# EAGLE design 1-4 (EAGLE 9.6.2)
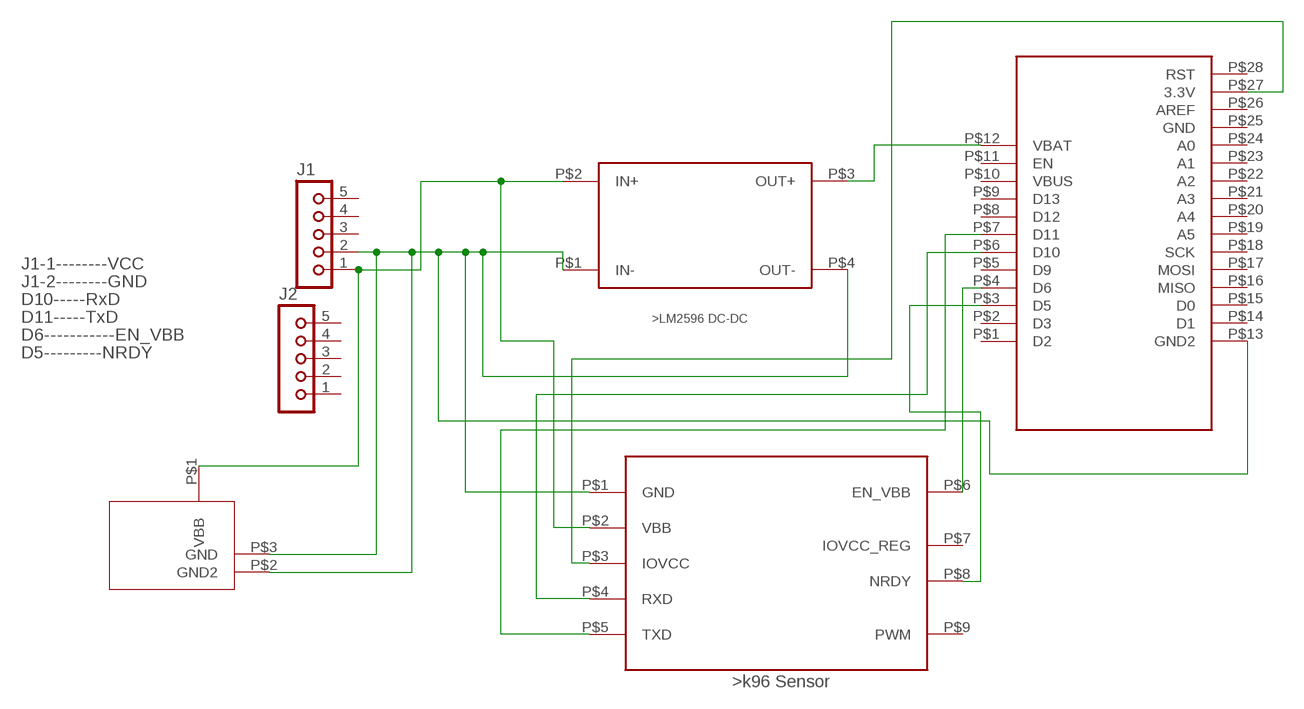
[diagram p0: schematic, sheet 1]

## Parts
DCDC1  DCDC  [DCDC]
FEATHER1  FEATHER  [FEATHER]
J1  JU05  [JU05]
J2  JU05  [JU05]
K96SENSOR1  K96SENSOR  [K96SENSOR]
U$1  POWER  [POWERIN]

## Nets
N$1: DCDC1.P$2(IN+) J1.1 K96SENSOR1.P$2(VBB) U$1.P$1(VBB)
N$2: DCDC1.P$1(IN-) DCDC1.P$4(OUT-) FEATHER1.P$13(GND2) J1.2 K96SENSOR1.P$1(GND) U$1.P$2(GND2) U$1.P$3(GND)
N$3: FEATHER1.P$6(D10) K96SENSOR1.P$4(RXD)
N$4: DCDC1.P$3(OUT+) FEATHER1.P$12(VBAT)
N$5: FEATHER1.P$7(D11) K96SENSOR1.P$5(TXD)
N$6: FEATHER1.P$4(D6) K96SENSOR1.P$6(EN_VBB)
N$7: FEATHER1.P$3(D5) K96SENSOR1.P$8(NRDY)
N$9: FEATHER1.P$27(3.3V) K96SENSOR1.P$3(IOVCC)
Unconnected: FEATHER1.P$1(D2) FEATHER1.P$2(D3) FEATHER1.P$5(D9) FEATHER1.P$8(D12) FEATHER1.P$9(D13) FEATHER1.P$10(VBUS) FEATHER1.P$11(EN) FEATHER1.P$14(D1) FEATHER1.P$15(D0) FEATHER1.P$16(MISO) FEATHER1.P$17(MOSI) FEATHER1.P$18(SCK) FEATHER1.P$19(A5) FEATHER1.P$20(A4) FEATHER1.P$21(A3) FEATHER1.P$22(A2) FEATHER1.P$23(A1) FEATHER1.P$24(A0) FEATHER1.P$25(GND) FEATHER1.P$26(AREF) FEATHER1.P$28(RST) J1.3 J1.4 J1.5 J2.1 J2.2 J2.3 J2.4 J2.5 K96SENSOR1.P$7(IOVCC_REG) K96SENSOR1.P$9(PWM)

## Notes on the sheet
- J1-1--------VCC
- J1-2--------GND
- D10-----RxD
- D11-----TxD
- D6-----------EN_VBB
- D5---------NRDY

## Library data of the parts
DCDC1 = untitled:DCDC
FEATHER1 = untitled:FEATHER
J1 J2 = con-lsta:JU05: PIN HEADER; OC_FARNELL: unknown; OC_NEWARK: unknown
K96SENSOR1 = untitled:K96SENSOR
U$1 = untitled:POWER

## Board
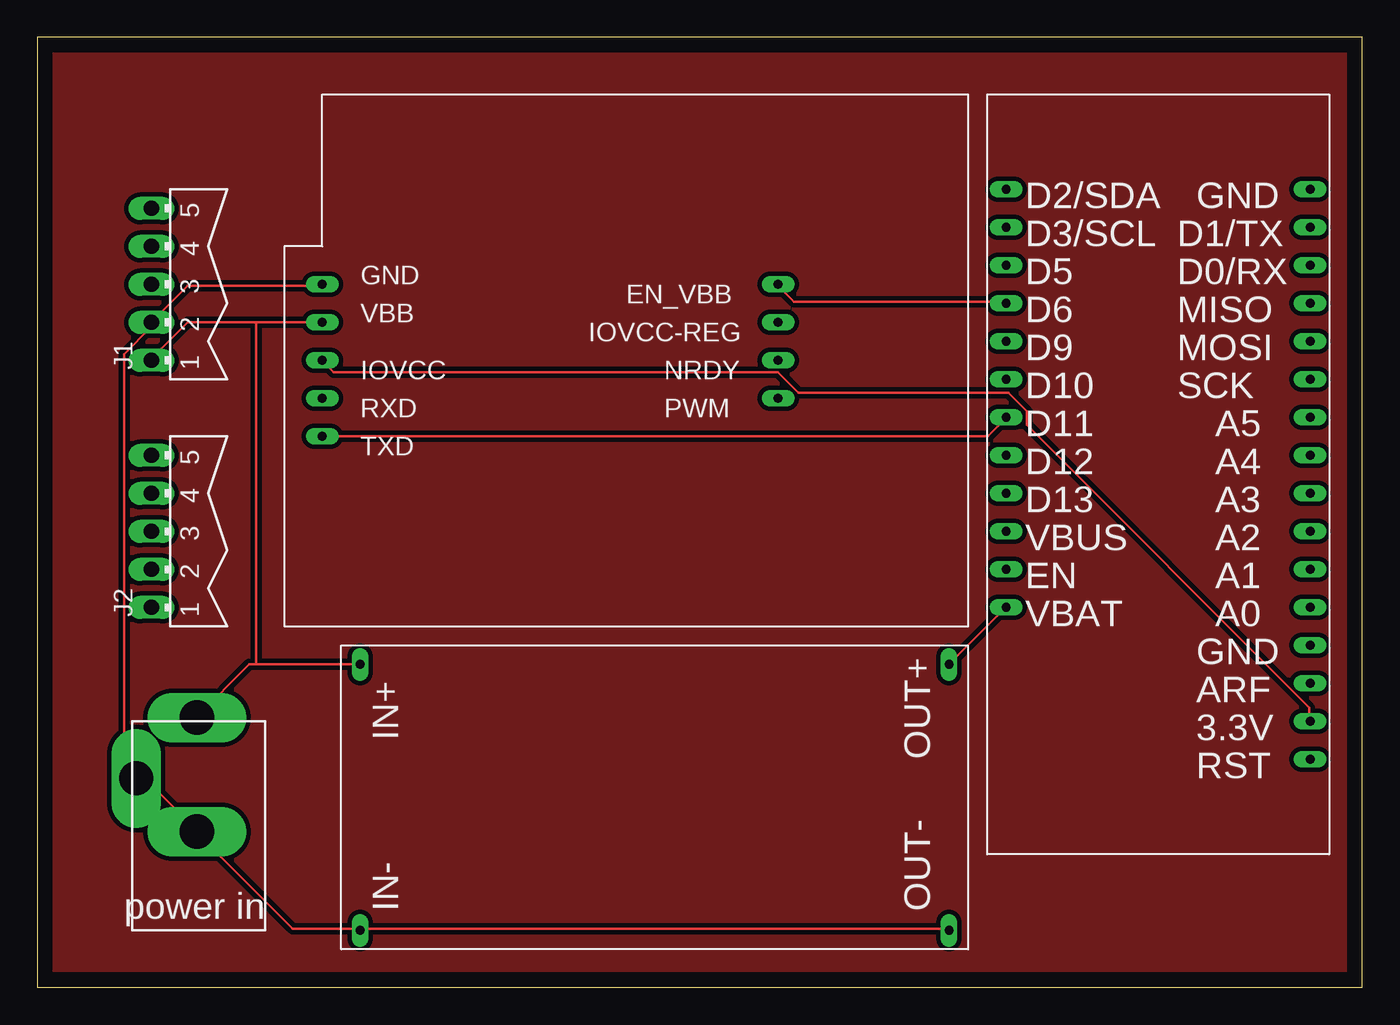
[diagram p1: board, top side]
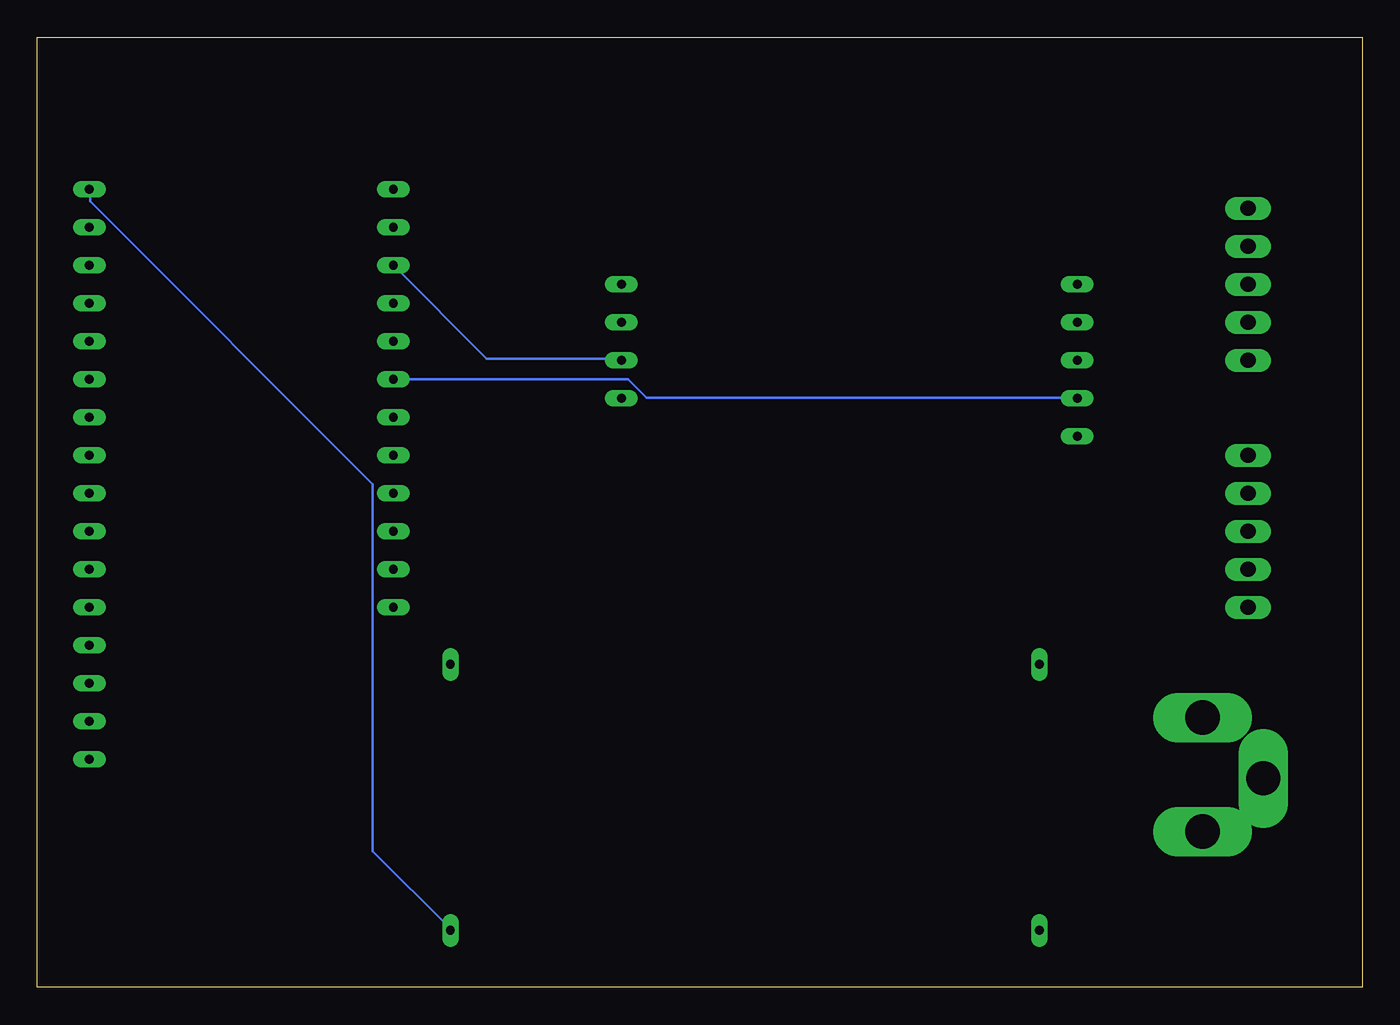
[diagram p2: board, bottom side, seen from below]

Size 88.57 x 63.49 mm. Coordinates in mm from the lower left corner, seen from the top.
Outline: 0,0 88.57,0 88.57,63.49 0,63.49 0,0
Copper layers (1*16): Top 0.035mm / dielectric 1.5mm / Bottom 0.035mm
Design rules "default": minimum track width 6mil, minimum drill 0.35mm, track to track 6mil, track to pad 6mil, pad to pad 6mil, via to via 6mil, smd to smd 6mil, copper to edge 40mil, drill to drill 6mil, minimum pad ring 10mil, minimum via ring 8mil, stop-mask expansion 4mil, vias tented up to drill 0mil, thermal gap 10mil

### Footprints (pad centres in the part's own frame; a part is rotated, then mirrored left to right if it is on the bottom)
DCDC = drill 0.6 long: P$1 -17.78,0; P$2 0,0; P$3 0,-39.37; P$4 -17.78,-39.37
FEATHER = drill 0.6 long: P$1 0,-5.08; P$2 0,-7.62; P$3 0,-10.16; P$4 0,-12.7; P$5 0,-15.24; P$6 0,-17.78; P$7 0,-20.32; P$8 0,-22.86; P$9 0,-25.4; P$10 0,-27.94; P$11 0,-30.48; P$12 0,-33.02; P$13 20.32,-5.08; P$14 20.32,-7.62; P$15 20.32,-10.16; P$16 20.32,-12.7; P$17 20.32,-15.24; P$18 20.32,-17.78; P$19 20.32,-20.32; P$20 20.32,-22.86; P$21 20.32,-25.4; P$22 20.32,-27.94; P$23 20.32,-30.48; P$24 20.32,-33.02; P$25 20.32,-35.56; P$26 20.32,-38.1; P$27 20.32,-40.64; P$28 20.32,-43.18
JU05 = drill 1.016 long: 1 -5.08,0; 2 -2.54,0; 3 0,0; 4 2.54,0; 5 5.08,0
K96SENSOR = drill 0.6 long: P$1 -17.78,-5.08; P$2 -17.78,-7.62; P$3 -17.78,-10.16; P$4 -17.78,-12.7; P$5 -17.78,-15.24; P$6 12.7,-5.08; P$7 12.7,-7.62; P$8 12.7,-10.16; P$9 12.7,-12.7
POWERIN = drill 2.286 pad 2.54 long: P$1 4.572,-14.224; P$2 4.572,-6.604; P$3 8.636,-10.16

### Placement (x,y rotation side)
DCDC1  21.59,21.59 90 top
FEATHER1  64.77,58.42 0 top
J1  7.62,46.99 90 top
J2  7.62,30.48 90 top
K96SENSOR1  36.83,52.07 0 top
U$1  15.24,3.81 180 top

### Tracks (layer width: path | path; a pad name or v marks a point on that pad's centre or on a via)
GND
  pour Top (isolate 0.305): 0,63.5 88.9,63.5 88.9,59.69 88.9,0 0,0
N$1
  Top 0.152: 14.63,44.45 10.06,44.45 7.62,42.01 J1.1 | 14.63,44.45 K96SENSOR1.P$2 | 14.63,21.59 14.17,21.59 10.67,18.08 U$1.P$1 | 14.63,21.59 DCDC1.P$2 | 14.63,21.59 14.63,44.45
N$2
  Top 0.152: K96SENSOR1.P$1 19.05,46.89 10.06,46.89 J1.2 7.62,44.14 5.79,42.32 5.79,14.73 6.55,13.97 U$1.P$3 7.16,13.97 10.67,10.46 U$1.P$2 10.67,10.31 17.07,3.91 21.49,3.91 DCDC1.P$1 21.64,3.91 60.96,3.91 DCDC1.P$4
  Bottom 0.152: FEATHER1.P$13 85.04,53.29 85.04,52.53 66.14,33.63 66.14,9.09 60.96,3.91 DCDC1.P$4
N$3
  Bottom 0.152: FEATHER1.P$6 49.07,40.64 47.85,39.42 19.05,39.42 K96SENSOR1.P$4
N$4
  Top 0.152: FEATHER1.P$12 DCDC1.P$3
N$5
  Top 0.152: K96SENSOR1.P$5 63.55,36.83 64.77,38.05 FEATHER1.P$7
N$6
  Top 0.152: FEATHER1.P$4 64.77,45.82 50.6,45.82 49.53,46.89 K96SENSOR1.P$6
N$7
  Bottom 0.152: FEATHER1.P$3 58.52,42.01 49.53,42.01 K96SENSOR1.P$8
N$9
  Top 0.152: FEATHER1.P$27 85.04,17.78 85.04,18.69 66.14,37.59 66.14,38.51 64.92,39.73 50.9,39.73 49.53,41.1 19.81,41.1 19.05,41.86 K96SENSOR1.P$3